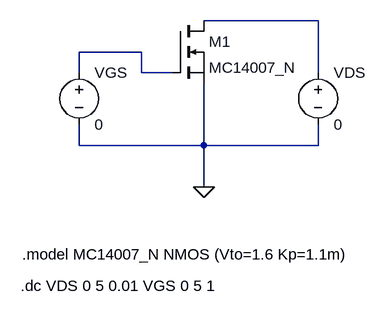
[diagram p0: schematic 1.1.1.asc]
1.1.1.asc, the LTspice schematic file:
Version 4
SHEET 1 880 680
WIRE 512 -32 336 -32
WIRE 240 16 144 16
WIRE 144 48 144 16
WIRE 240 48 240 16
WIRE 288 48 240 48
WIRE 512 48 512 -32
WIRE 144 160 144 128
WIRE 336 160 336 64
WIRE 336 160 144 160
WIRE 512 160 512 128
WIRE 512 160 336 160
WIRE 336 224 336 160
FLAG 336 224 0
SYMBOL voltage 144 32 R0
SYMATTR InstName VGS
SYMATTR Value 0
SYMBOL voltage 512 32 R0
SYMATTR InstName VDS
SYMATTR Value 0
SYMBOL nmos 288 -32 R0
SYMATTR InstName M1
SYMATTR Value MC14007_N
TEXT 56 328 Left 2 !.model MC14007_N NMOS (Vto=1.6 Kp=1.1m)
TEXT 54 376 Left 2 !.dc VDS 0 5 0.01 VGS 0 5 1

The netlist it stands for:
* 1.1.1.asc
VGS N002 0 0
VDS N001 0 0
M1 N001 N002 0 0 MC14007_N
.model NMOS NMOS
.model PMOS PMOS
.lib standard.mos
.model MC14007_N NMOS (Vto=1.6 Kp=1.1m)
.dc VDS 0 5 0.01 VGS 0 5 1
.backanno
.end